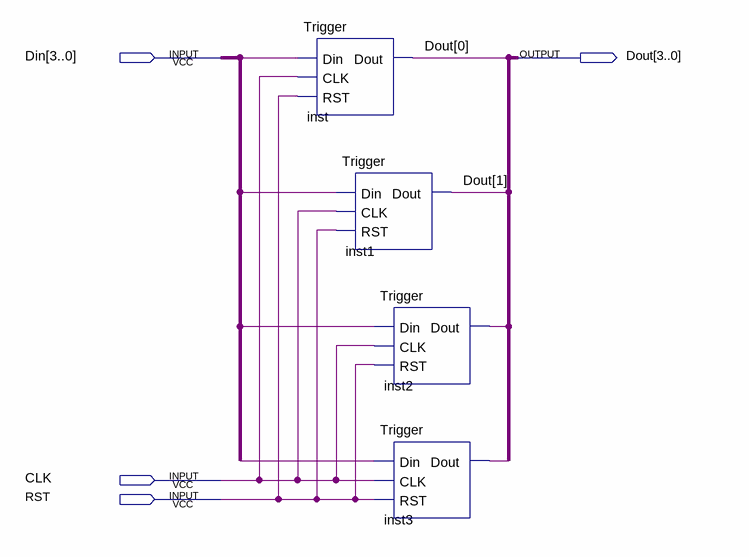
[diagram p0: schematic sheet]
// Quartus schematic FourBitsTrigger.bdf as structural Verilog: 4 symbols, 4 pins
module FourBitsTrigger (
  input  [3:0] Din,
  input  CLK,
  input  RST,
  output [3:0] Dout
);

  Trigger inst (.Din(Din[0]), .CLK(CLK), .RST(RST), .Dout(Dout[0]));
  Trigger inst1 (.Din(Din[1]), .CLK(CLK), .RST(RST), .Dout(Dout[1]));
  Trigger inst2 (.Din(Din[2]), .CLK(CLK), .RST(RST), .Dout(Dout[2]));
  Trigger inst3 (.Din(Din[3]), .CLK(CLK), .RST(RST), .Dout(Dout[3]));
endmodule
